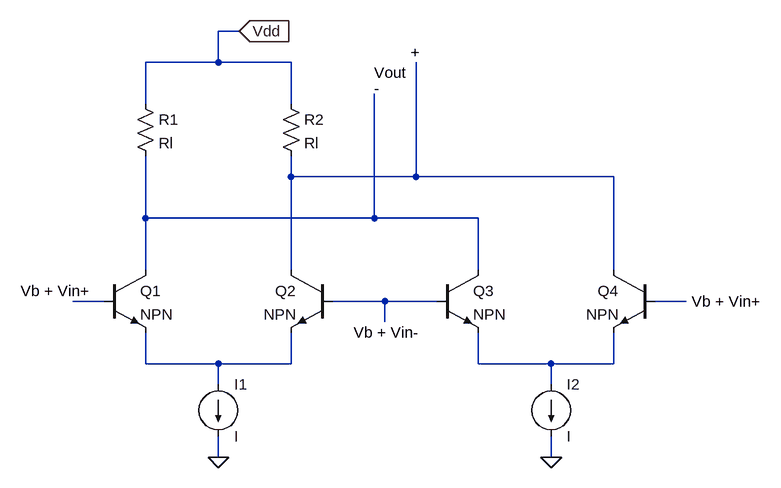
[diagram p0: schematic 2_Cross Coupled Diff Amp.asc]
2_Cross Coupled Diff Amp.asc, the LTspice schematic file:
Version 4
SHEET 1 1112 680
WIRE 304 -96 272 -96
WIRE 272 -48 272 -96
WIRE 272 -48 160 -48
WIRE 384 -48 272 -48
WIRE 160 16 160 -48
WIRE 384 16 384 -48
WIRE 384 128 384 96
WIRE 576 128 576 -48
WIRE 576 128 384 128
WIRE 880 128 576 128
WIRE 160 192 160 96
WIRE 512 192 512 0
WIRE 512 192 160 192
WIRE 672 192 512 192
WIRE 160 272 160 192
WIRE 384 272 384 128
WIRE 672 272 672 192
WIRE 880 272 880 128
WIRE 96 320 48 320
WIRE 528 320 448 320
WIRE 608 320 528 320
WIRE 992 320 944 320
WIRE 528 352 528 320
WIRE 160 416 160 368
WIRE 272 416 160 416
WIRE 384 416 384 368
WIRE 384 416 272 416
WIRE 672 416 672 368
WIRE 784 416 672 416
WIRE 880 416 880 368
WIRE 880 416 784 416
WIRE 272 448 272 416
WIRE 784 448 784 416
WIRE 272 560 272 528
WIRE 784 560 784 528
FLAG 304 -96 Vdd
IOPIN 304 -96 In
FLAG 272 560 0
FLAG 784 560 0
SYMBOL npn 96 272 R0
SYMATTR InstName Q1
SYMBOL npn 448 272 M0
SYMATTR InstName Q2
SYMBOL npn 608 272 R0
SYMATTR InstName Q3
SYMBOL npn 944 272 M0
SYMATTR InstName Q4
SYMBOL res 144 0 R0
SYMATTR InstName R1
SYMATTR Value Rl
SYMBOL res 368 0 R0
SYMATTR InstName R2
SYMATTR Value Rl
SYMBOL current 272 448 R0
SYMATTR InstName I1
SYMBOL current 784 448 R0
SYMATTR InstName I2
TEXT 480 368 Left 2 !Vb + Vin-
TEXT 1000 320 Left 2 !Vb + Vin+
TEXT -32 304 Left 2 !Vb + Vin+
TEXT 568 -64 Left 2 !+
TEXT 512 -8 Left 2 !-
TEXT 512 -32 Left 2 !Vout

The netlist it stands for:
* 2_Cross Coupled Diff Amp.asc
Q1 N002 N003 N006 0 NPN
Q2 N001 N004 N006 0 NPN
Q3 N002 N004 N007 0 NPN
Q4 N001 N005 N007 0 NPN
R1 Vdd N002 Rl
R2 Vdd N001 Rl
I1 N006 0 I
I2 N007 0 I
.model NPN NPN
.model PNP PNP
.lib standard.bjt
Vb + Vin-
Vb + Vin+
Vb + Vin+
+
-
Vout
.backanno
.end